# EAGLE design luci2_device_revB (EAGLE 6.5.0)
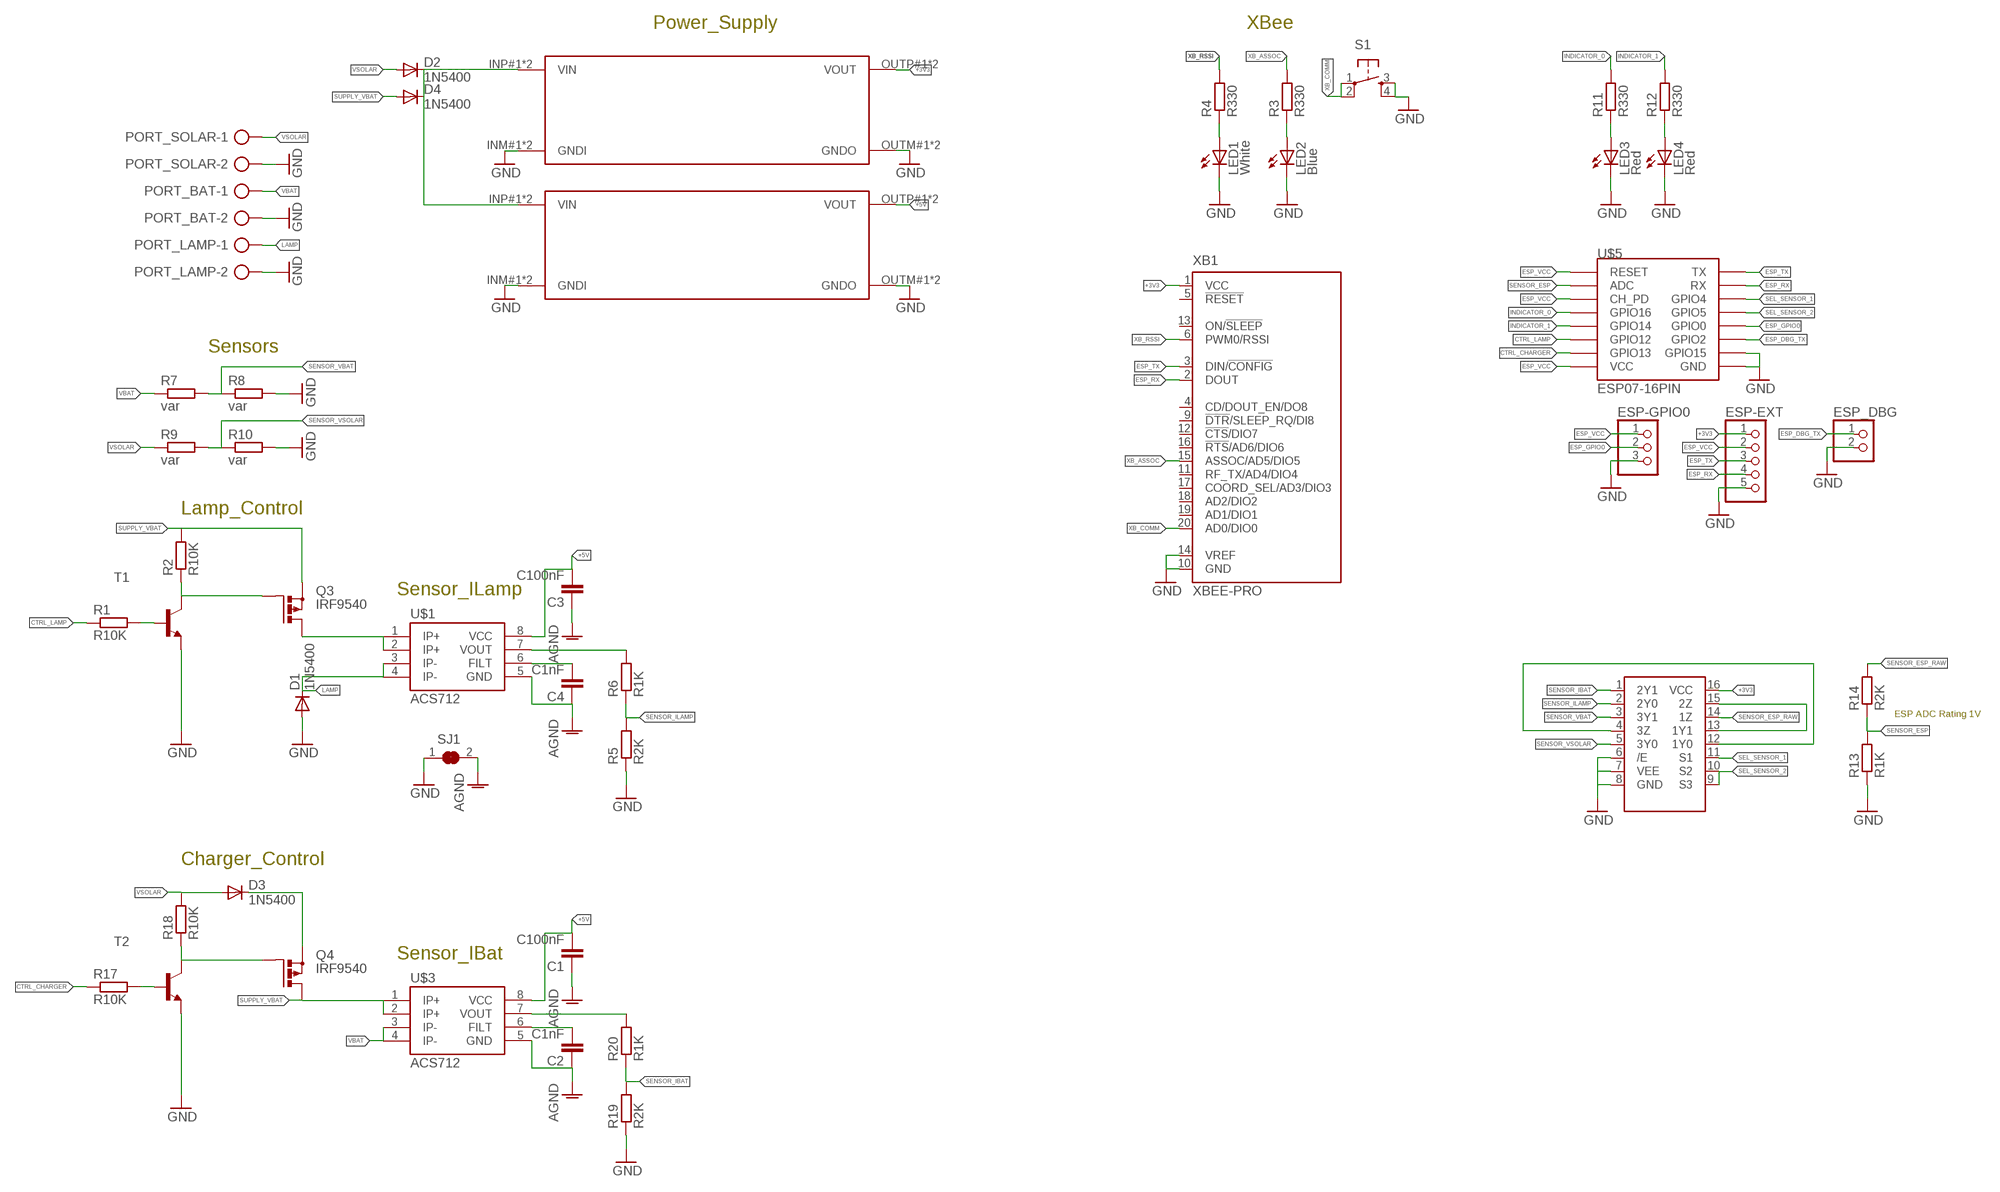
[diagram p0: schematic, sheet 1]

## Parts
C1  C100nF  C-EUC0805  [C0805]
C2  C1nF  C-EUC0805  [C0805]
C3  C100nF  C-EUC0805  [C0805]
C4  C1nF  C-EUC0805  [C0805]
D1  1N5400  [DO201-15]
D2  1N5400  [DO201-15]
D3  1N5400  [DO201-15]
D4  1N5400  [DO201-15]
ESP-EXT  HEADER-1X5ROUND  [1X05_ROUND]
ESP-GPIO0  HEADER-1X3ROUND  [1X03_ROUND]
ESP_DBG  HEADER-1X2ROUND  [1X02_ROUND]
LED1  White  LEDCHIPLED_0805  [CHIPLED_0805]
LED2  Blue  LEDCHIPLED_0805  [CHIPLED_0805]
LED3  Red  LEDCHIPLED_0805  [CHIPLED_0805]
LED4  Red  LEDCHIPLED_0805  [CHIPLED_0805]
PORT_BAT  AK300/2  [AK300/2]
PORT_LAMP  AK300/2  [AK300/2]
PORT_SOLAR  AK300/2  [AK300/2]
Q3  IRF9540  PMOSFET_PTO220BV  [TO220BV]
Q4  IRF9540  PMOSFET_PTO220BV  [TO220BV]
R1  R10K  R-EU_M0805  [M0805]
R2  R10K  R-EU_M0805  [M0805]
R3  R330  R-EU_M0805  [M0805]
R4  R330  R-EU_M0805  [M0805]
R5  R2K  R-EU_M0805  [M0805]
R6  R1K  R-EU_M0805  [M0805]
R7  var  R-EU_M0805  [M0805]
R8  var  R-EU_M0805  [M0805]
R9  var  R-EU_M0805  [M0805]
R10  var  R-EU_M0805  [M0805]
R11  R330  R-EU_M0805  [M0805]
R12  R330  R-EU_M0805  [M0805]
R13  R1K  R-EU_M0805  [M0805]
R14  R2K  R-EU_M0805  [M0805]
R17  R10K  R-EU_M0805  [M0805]
R18  R10K  R-EU_M0805  [M0805]
R19  R2K  R-EU_M0805  [M0805]
R20  R1K  R-EU_M0805  [M0805]
S1  TAC_SWITCHPTH  [TACTILE-PTH]
SJ1  SOLDERJUMPER_CLOSED  [SOLDERJUMPER_CLOSEDWIRE]
T1  MMBT2222ALT1-NPN-SOT23-BEC  [SOT23-BEC]
T2  MMBT2222ALT1-NPN-SOT23-BEC  [SOT23-BEC]
U$1  ACS712  [SO08]
U$2  DCDCMODULE_SMALL  [DCDCMODULE-SMALL]
U$3  ACS712  [SO08]
U$4  DCDCMODULE_SMALL  [DCDCMODULE-SMALL]
U$5  ESP07-16PIN  [ESP07-16PIN]
U$6  74HC4053D  [SO16]
XB1  XBEE-PRO  [XBEE-PRO]

## Nets
+3V3: ESP-EXT.1 U$4.OUTP#1(VOUT) U$4.OUTP#2(VOUT) U$6.16(VCC) XB1.1(VCC)
+5V: C1.2 C3.2 U$1.8(VCC) U$2.OUTP#1(VOUT) U$2.OUTP#2(VOUT) U$3.8(VCC)
AGND: C1.1 C2.1 C3.1 C4.1 SJ1.2 U$1.5(GND) U$3.5(GND)
CTRL_CHARGER: R17.1 U$5.GPIO13
CTRL_LAMP: R1.1 U$5.GPIO12
ESP_DBG_TX: ESP_DBG.1 U$5.GPIO2
ESP_GPIO0: ESP-GPIO0.2 U$5.GPIO0
ESP_RX: ESP-EXT.4 U$5.RX XB1.2(DOUT)
ESP_TX: ESP-EXT.3 U$5.TX XB1.3(DIN/!CONFIG)
ESP_VCC: ESP-EXT.2 ESP-GPIO0.1 U$5.CH_PD U$5.REST(RESET) U$5.VCC
GND: D1.A ESP-EXT.5 ESP-GPIO0.3 ESP_DBG.2 LED1.C LED2.C LED3.C LED4.C PORT_BAT.2 PORT_LAMP.2 PORT_SOLAR.2 R5.1 R8.2 R10.2 R13.1 R19.1 S1.3 S1.4 SJ1.1 T1.E T2.E U$2.INM#1(GNDI) U$2.INM#2(GNDI) U$2.OUTM#1(GNDO) U$2.OUTM#2(GNDO) U$4.INM#1(GNDI) U$4.INM#2(GNDI) U$4.OUTM#1(GNDO) U$4.OUTM#2(GNDO) U$5.GND U$5.GPIO15 U$6.6(/E) U$6.7(VEE) U$6.8(GND) XB1.10(GND) XB1.14(VREF)
INDICATOR_0: R11.2 U$5.GPIO16
INDICATOR_1: R12.2 U$5.GPIO14
LAMP: D1.C PORT_LAMP.1 U$1.3(IP-) U$1.4(IP-)
N$1: Q3.D U$1.1(IP+) U$1.2(IP+)
N$2: Q3.G R2.1 T1.C
N$3: LED1.A R4.1
N$4: R1.2 T1.B
N$5: LED2.A R3.1
N$6: U$6.13(1Y1) U$6.15(2Z)
N$7: R6.2 U$1.7(VOUT)
N$8 [VCC]: D2.C D4.C U$2.INP#1(VIN) U$2.INP#2(VIN) U$4.INP#1(VIN) U$4.INP#2(VIN)
N$9: U$6.4(3Z) U$6.12(1Y0)
N$10: R17.2 T2.B
N$11: C4.2 U$1.6(FILT)
N$12: Q4.G R18.1 T2.C
N$13: D3.C Q4.S
N$15: LED3.A R11.1
N$16: LED4.A R12.1
N$17: C2.2 U$3.6(FILT)
N$18: R20.2 U$3.7(VOUT)
SEL_SENSOR_1: U$5.GPIO4 U$6.11(S1)
SEL_SENSOR_2: U$5.GPIO5 U$6.9(S3) U$6.10(S2)
SENSOR_ESP: R13.2 R14.1 U$5.ADC
SENSOR_ESP_RAW: R14.2 U$6.14(1Z)
SENSOR_IBAT: R19.2 R20.1 U$6.1(2Y1)
SENSOR_ILAMP: R5.2 R6.1 U$6.2(2Y0)
SENSOR_VBAT: R7.2 R8.1 U$6.3(3Y1)
SENSOR_VSOLAR: R9.2 R10.1 U$6.5(3Y0)
SUPPLY_VBAT: D4.A Q3.S Q4.D R2.2 U$3.1(IP+) U$3.2(IP+)
VBAT: PORT_BAT.1 R7.1 U$3.3(IP-) U$3.4(IP-)
VSOLAR: D2.A D3.A PORT_SOLAR.1 R9.1 R18.2
XB_ASSOC: R3.2 XB1.15(ASSOC/AD5/DIO5)
XB_COMM: S1.1 S1.2 XB1.20(AD0/DIO0)
XB_RSSI: R4.2 XB1.6(PWM0/RSSI)
Unconnected: XB1.4(CD/DOUT_EN/DO8) XB1.5(!RESET) XB1.9(!DTR!/SLEEP_RQ/DI8) XB1.11(RF_TX/AD4/DIO4) XB1.12(!CTS!/DIO7) XB1.13(ON/!SLEEP) XB1.16(!RTS!/AD6/DIO6) XB1.17(COORD_SEL/AD3/DIO3) XB1.18(AD2/DIO2) XB1.19(AD1/DIO1)

## Notes on the sheet
- Power_Supply | XBee
- Sensors
- Lamp_Control
- Sensor_ILamp
- ESP ADC Rating 1V
- Charger_Control
- Sensor_IBat

## Library data of the parts
C1-C4 = resistor:C-EU: CAPACITOR, European symbol
D1-D4 = diode:1N5400: DIODE standard rectifier, 3 A, 50 V (Motorola)
ESP-EXT = microbuilder:HEADER-1X5: PIN HEADER
ESP-GPIO0 = microbuilder:HEADER-1X3: PIN HEADER
ESP_DBG = microbuilder:HEADER-1X2: PIN HEADER
LED1-LED4 = adafruit:LED: LED OSRAM: - CHIPLED LG R971, LG N971, LY N971, LG Q971, LY Q971, LO R971, LY R971 LH N974, LH R974 LS Q976, LO Q976, LY Q976 LO Q996 - Hyper CHIPLED LW Q18S LB Q993, LB Q99A, LB R99A - SideLED LS A670, LO A670, LY A670, LG A670, LP A670 LB A673, LV A673, LT A673, LW A673 LH A674 LY A675 LS A676, LA A676, LO A676, LY A676, LW A676 LS A679, LY A679, LG A679 - Hyper Micro SIDELED® LS Y876, LA Y876, LO Y876, LY Y876 LT Y87S - SmartLED LW L88C, LW L88S LB L89C, LB L89S, LG L890 LS L89K, LO L89K, LY L89K LS L896, LA L896, LO L896, LY L896 - TOPLED LS T670, LO T670, LY T670, LG T670, LP T670 LSG T670, LSP T670, LSY T670, LOP T670, LYG T670 LG T671, LOG T671, LSG T671 LB T673, LV T673, LT T673, LW T673 LH T674 LS T676, LA T676, LO T676, LY T676, LB T676, LH T676, LSB T676, LW T676 LB T67C, LV T67C, LT T67C, LS T67K, LO T67K, LY T67K, LW E67C LS E67B, LA E67B, LO E67B, LY E67B, LB E67C, LV E67C, LT E67C LW T67C LS T679, LY T679, LG T679 LS T770, LO T770, LY T770, LG T770, LP T770 LB T773, LV T773, LT T773, LW T773 LH T774 LS E675, LA E675, LY E675, LS T675 LS T776, LA T776, LO T776, LY T776, LB T776 LHGB T686 LT T68C, LB T68C - Hyper Mini TOPLED® LB M676 - Mini TOPLED Santana® LG M470 LS M47K, LO M47K, LY M47K Source: http://www.osram.convergy.de/
PORT_BAT PORT_LAMP PORT_SOLAR = con-ptr500:AK300/2: CONNECTOR; OC_FARNELL: unknown; OC_NEWARK: unknown
Q3 Q4 = transistor-power:PMOSFET_P: Power MOSFET P-Channel
R1-R14 R17-R20 = resistor:R-EU_: RESISTOR, European symbol
S1 = SparkFun-Electromechanical:TAC_SWITCH: Momentary Switch Button commonly used for reset or general input. Spark Fun Electronics SKU : COM-00097 SMT- SWCH-08247
SJ1 = microbuilder:SOLDERJUMPER_CLOSED: Solder Jumper - Closed These solder jumpers are closed by default CLOSEDWIRE - 10 mil trace between pads that can be cut and resoldered later CLOSEDPERM - 63 mil trace between pads for a permanent connection (used to 'bridge' two signals, a shameless hack for Eagle). Can double as a test point as well (no cream layer)
T1 T2 = transistor:*-NPN-: NPN Transistror BF959 corrected 2008.03.06
U$1 U$3 = SparkFun-AnalogIC:ACS712: Hall-effect-based isolated linear current sensor
U$2 U$4 = bontor:DCDCMODULE_SMALL
U$5 = esp8266modules:ESP07-16PIN: ESP8266 Wifi module 07 - 16 pins; DIMENSIONS: 22.0 x 16.0 mm; PINS: 16; PITCH: 0.078" / 2 mm
U$6 = tigorcustom:74HC4053D
XB1 = microbuilder:XBEE: XBee (TM) /XBee-PRO(TM) OEM RF Modules Source: MaxStream, Inc. xbee_productmanual.pdf

## Net classes
0 default: clearance 0.508 mm
1 GND: width 0.508 mm, drill 0.6 mm, clearance 0.762 mm
2 VCC: width 0.508 mm, drill 0.6 mm, clearance 0.762 mm

## Board
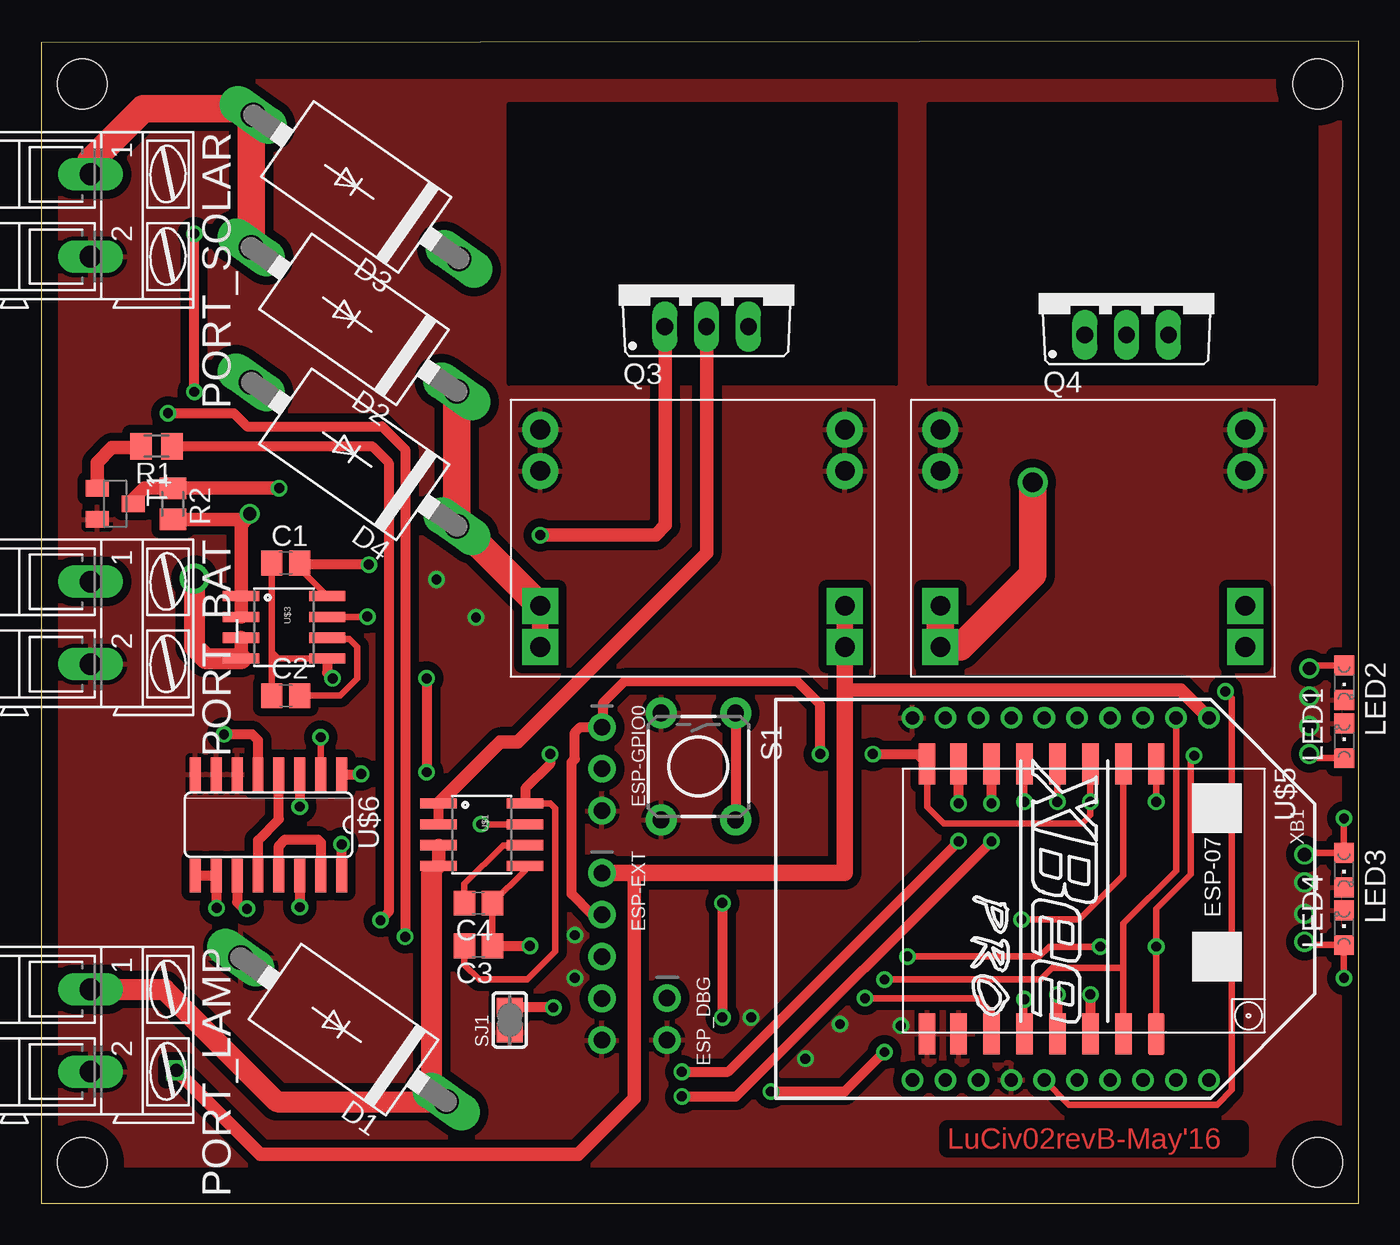
[diagram p1: board, top side]
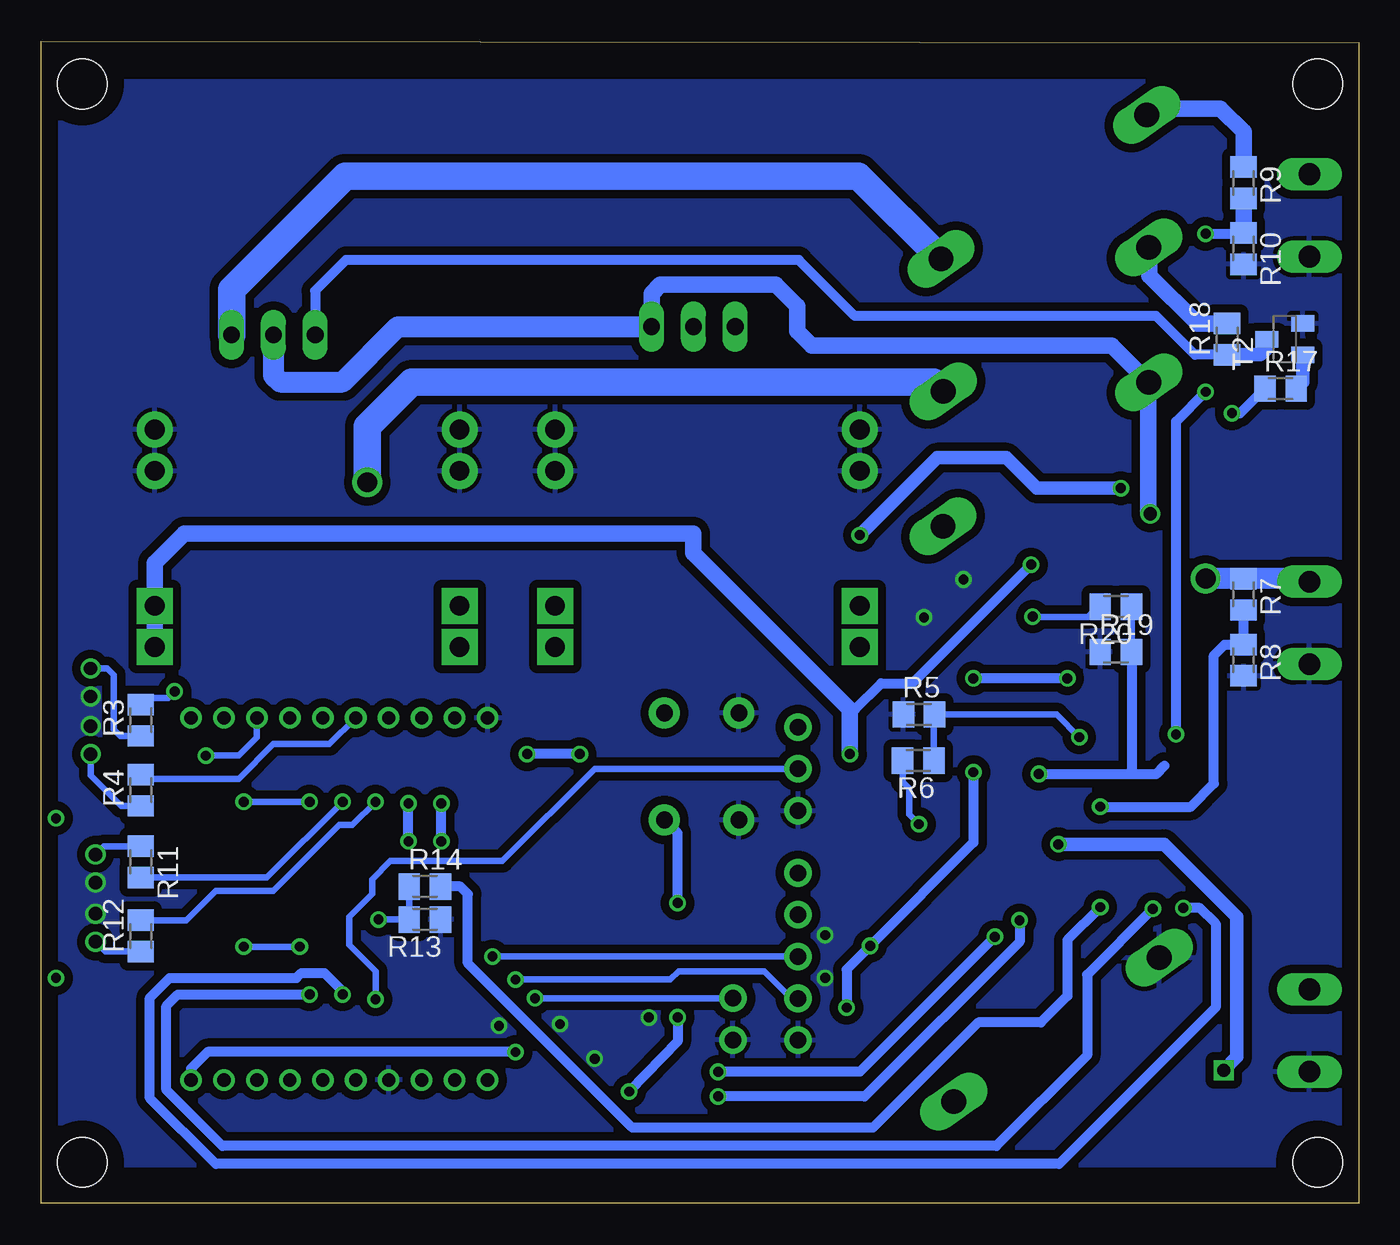
[diagram p2: board, bottom side, seen from below]

Size 80 x 70.6 mm. Coordinates in mm from the lower left corner, seen from the top.
Outline: 0,0 80,0 80,70.6 0,70.5 0,0
Copper layers (1*16): Top 0.035mm / dielectric 1.5mm / Bottom 0.035mm
Design rules "default": minimum track width 10mil, minimum drill 24mil, track to track 8mil, track to pad 8mil, pad to pad 8mil, via to via 8mil, smd to smd 8mil, copper to edge 40mil, drill to drill 8mil, minimum pad ring 10mil, minimum via ring 8mil, stop-mask expansion 4mil, vias tented up to drill 0mil, thermal gap 10mil
Holes 3 mm at 77.5,2.5 2.5,68 2.5,2.5 77.5,68
tKeepout: area 28.4,49.8 to 51.9,66.8; area 53.9,49.8 to 77.4,66.8

### Footprints (pad centres in the part's own frame; a part is rotated, then mirrored left to right if it is on the bottom)
C0805 = smd 1.3 x 1.5: 1 -0.85,0; 2 0.85,0
DO201-15 = drill 1.499 long: A 7.62,0; C -7.62,0
1X05_ROUND = drill 1 pad 1.676: 1 -5.08,0; 2 -2.54,0; 3 0,0; 4 2.54,0; 5 5.08,0
1X03_ROUND = drill 1 pad 1.676: 1 -2.54,0; 2 0,0; 3 2.54,0
1X02_ROUND = drill 1 pad 1.676: 1 -1.27,0; 2 1.27,0
CHIPLED_0805 = smd 1.2 x 1.2: A 0,-1.05; C 0,1.05
AK300/2 = drill 1.321 long: 1 -2.515,0; 2 2.489,0
TO220BV = drill 1.016 long: D 0,-2.54; G -2.54,-2.54; S 2.54,-2.54
M0805 = smd 1.3 x 1.6: 1 -0.95,0; 2 0.95,0
TACTILE-PTH = drill 1.016 pad 1.88: 1 -3.251,2.261; 2 3.251,2.261; 3 -3.251,-2.261; 4 3.251,-2.261
SOLDERJUMPER_CLOSEDWIRE = smd 1.168 x 1.6: 1 -0.762,0; 2 0.762,0 | smd 0.635 x 0.203: WIRE 0,0
SOT23-BEC = smd 1 x 1.4: B -0.95,-1.1; C 0,1.1; E 0.95,-1.1
SO08 = smd 0.61 x 2.21: 1 -1.905,-2.616; 2 -0.635,-2.616; 3 0.635,-2.616; 4 1.905,-2.616; 5 1.905,2.616; 6 0.635,2.616; 7 -0.635,2.616; 8 -1.905,2.616
DCDCMODULE-SMALL = drill 1.2 pad 2.184: INM#1 1.8,15; INM#2 1.8,12.5; OUTM#1 20.3,15; OUTM#2 20.3,12.5 | drill 1.2 pad 2.184 square: INP#1 1.8,4.3; INP#2 1.8,1.8; OUTP#1 20.3,4.3; OUTP#2 20.3,1.8
ESP07-16PIN = smd 2.5 x 1: ADC -8.2,3.8; CH_PD -8.2,1.8; GND 8.2,-8.105; GPIO0 8.2,-2.2; GPIO2 8.2,-4.2; GPIO4 8.2,1.8; GPIO5 8.2,-0.2; GPIO12 -8.2,-4.2; GPIO13 -8.2,-6.2; GPIO14 -8.2,-2.2; GPIO15 8.2,-6.2; GPIO16 -8.2,-0.2; REST -8.2,5.8; RX 8.2,3.8; TX 8.2,5.8; VCC -8.2,-8.105
SO16 = smd 0.66 x 2.032: 1 -4.445,-3.073; 2 -3.175,-3.073; 3 -1.905,-3.073; 4 -0.635,-3.073; 5 0.635,-3.073; 6 1.905,-3.073; 7 3.175,-3.073; 8 4.445,-3.073; 9 4.445,3.073; 10 3.175,3.073; 11 1.905,3.073; 12 0.635,3.073; 13 -0.635,3.073; 14 -1.905,3.073; 15 -3.175,3.073; 16 -4.445,3.073
XBEE-PRO = drill 0.8 pad 1.27: 1 -11,9; 2 -11,7; 3 -11,5; 4 -11,3; 5 -11,1; 6 -11,-1; 7 -11,-3; 8 -11,-5; 9 -11,-7; 10 -11,-9; 11 11,-9; 12 11,-7; 13 11,-5; 14 11,-3; 15 11,-1; 16 11,1; 17 11,3; 18 11,5; 19 11,7; 20 11,9

### Placement (x,y rotation side)
C1  14.85,38.9 0 top
C2  14.85,30.85 0 top
C3  26.55,15.65 180 top
C4  26.55,18.25 180 top
D1  18.36,10.56 145 top
D2  18.99,53.7 145 top
D3  19.12,61.75 145 top
D4  19,45.5 145 top
ESP-EXT  34.05,15 270 top
ESP-GPIO0  34.05,26.4 270 top
ESP_DBG  38,11.2 270 top
LED1  79.11,28.1 0 top
LED2  79.11,31.63 180 top
LED3  79.1,20.25 180 top
LED4  79.1,16.75 0 top
PORT_BAT  3,35.25 270 top
PORT_LAMP  3,10.5 270 top
PORT_SOLAR  3,60 270 top
Q3  40.4,55.8 0 top
Q4  65.9,55.3 0 top
R1  7,46 180 top
R2  8,42.5 270 top
R3  73.95,29.35 90 bottom
R4  73.95,25.1 90 bottom
R5  26.7,29.7 0 bottom
R6  26.75,26.9 180 bottom
R7  7,37 270 bottom
R8  7,33 270 bottom
R9  7,62 270 bottom
R10  7,58 270 bottom
R11  73.95,20.75 270 bottom
R12  73.95,16.25 90 bottom
R13  56.7,17.25 180 bottom
R14  56.7,19.25 0 bottom
R17  4.75,49.5 0 bottom
R18  8,52.5 90 bottom
R19  14.75,33.5 0 bottom
R20  14.75,36.25 180 bottom
S1  39.9,26.55 270 top
SJ1  28.45,11.15 90 top
T1  4.5,42.5 270 top
T2  4.5,52.5 90 bottom
U$1  26.75,22.4 270 top
U$2  52.8,32 0 top
U$3  14.75,35 270 top
U$4  28.5,32 0 top
U$5  61.9,18.5 270 top
U$6  13.8,23 180 top
XB1  61.9,18.5 270 top

### Tracks (layer width: path | path; a pad name or v marks a point on that pad's centre or on a via)
+3V3  (via drill 0.6, 0.8)
  Top 0.61: U$6.16 v18.25,21.82
  Top 0.813: 36,20.08 36,6.4 32.6,3 13.3,3 v8.2,8.1 | XB1.1 69.2,31.2 48.8,31.2
  Top 1.016: U$4.OUTP#1 U$4.OUTP#2 48.8,31.2 48.8,20.08 36,20.08 ESP-EXT.1
  Bottom 0.813: v18.25,21.82 11.82,21.82 7.4,17.4 7.4,8.9 v8.2,8.1
+5V  (via drill 0.6)
  Top 0.406: C1.2 15.7,38.57 U$3.8 | U$1.8 30.89,24.3 31.2,24 31.2,15.3 29.5,13.6 26.6,13.6 25.7,14.5 C3.2
  Top 0.61: v30.9,27.3 30.9,26.7 29.4,25.2 29.4,24.34 U$1.8 | v19.9,38.8 15.8,38.8 C1.2
  Bottom 0.61: 30.9,30 30.6,30 29,31.6 27.1,31.6 v19.9,38.8
  Bottom 1.016: v30.9,27.3 30.9,30 40.4,39.5 40.4,40.7 71.3,40.7 73.1,38.9 U$2.OUTP#1 U$2.OUTP#2
AGND  (via drill 0.6)
  Top 0.406: U$3.5 14.4,33.09 14,33.5 | C2.1 14,33.5 | C1.1 14,33.5 | U$1.5 29.37,20.22 C4.1 C3.1
  Top 0.61: C3.1 v29.67,15.65 | v31.1,11.9 31.09,11.91 SJ1.2 | U$3.5 17.37,32.23 v17.7,31.9 | v23.4,31.9 v23.4,26.2
  Bottom 0.61: v31.1,11.9 31.1,14.22 v29.67,15.65 23.4,21.92 v23.4,26.2 | v17.7,31.9 v23.4,31.9
CTRL_CHARGER  (via drill 0.6)
  Top 0.61: v7.7,48 11.7,48 12.5,47.2 20.7,47.2 22.1,45.8 v22.1,16.2 | v38.9,8 41.7,8 v55.7,22 | v55.7,24.3 U$5.GPIO13
  Bottom 0.61: R17.1 7.2,48 v7.7,48 | v22.1,16.2 30.3,8 v38.9,8 | v55.7,22 v55.7,24.3
CTRL_LAMP  (via drill 0.6)
  Top 0.61: R1.1 20.1,46 21.1,45 21.1,17.7 v20.6,17.2 | v38.9,6.5 42.2,6.5 v57.7,22 | v57.7,24.3 U$5.GPIO12
  Bottom 0.61: v20.6,17.2 20.6,15.9 30,6.5 v38.9,6.5 | v57.7,22 v57.7,24.3
ESP_DBG_TX  (via drill 0.6)
  Top 0.406: v50.02,12.47 56.83,12.47 57.7,11.6 U$5.GPIO2
  Bottom 0.406: ESP_DBG.1 v50.02,12.47
ESP_GPIO0  (via drill 0.6)
  Top 0.406: U$5.GPIO0 v59.7,12.4
  Bottom 0.406: v59.7,12.4 59.7,14.1 61.3,15.7 61.3,17.4 59.9,18.8 59.9,19.7 58.8,20.8 52,20.8 46.4,26.4 ESP-GPIO0.2
ESP_RX  (via drill 0.6)
  Top 0.406: XB1.2 68.9,20.2 65.7,17 65.7,14.3 | 65.7,14.3 U$5.RX | v51.2,13.6 60.7,13.6 61.4,14.3 65.7,14.3
  Bottom 0.406: ESP-EXT.4 34.46,12.46 36.1,14.1 41.3,14.1 41.8,13.6 v51.2,13.6
ESP_TX  (via drill 0.6)
  Top 0.406: v70,27.2 69.8,27 69.8,20 67.7,17.9 v67.7,15.6 U$5.TX | v52.6,15 60.6,15 61.2,15.6 v64.3,15.6
  Bottom 0.406: v70,27.2 68,27.2 66.9,28.3 XB1.3 | ESP-EXT.3 v52.6,15 | v64.3,15.6 v67.7,15.6
ESP_VCC  (via drill 0.6)
  Top 0.406: U$5.CH_PD v63.7,24.4 63.7,23.6 63.2,23.1 54.8,23.1 53.8,24.1 U$5.VCC | v67.7,24.4 U$5.REST
  Top 0.61: ESP-EXT.2 33.46,17.54 32.2,18.8 32.2,26.8 32.4,27 32.4,28.6 32.74,28.94 ESP-GPIO0.1 34.1,28.99 34.1,30.4 35.4,31.7 45.9,31.7 47.3,30.3 v47.3,27.3 | v50.5,27.3 53.2,27.3 U$5.VCC
  Bottom 0.406: v63.7,24.4 v67.7,24.4
  Bottom 0.61: v47.3,27.3 v50.5,27.3
GND  (via drill 0.6, 0.81)
  other vias: 52.2,10.8 48.5,10.9 46.4,8.8 43.1,11.3 76.7,19.5 76.7,17.6 77,30.8 77,29 24,37.9 26.4,35.6 32.4,16.3 32.4,13.7
  pour Top: 0,70.5 80,70.5 80,0 0,0
  pour Bottom: 0,70.5 80,70.5 80,0 0,0
HEATSINK
  cutout Top: 28.4,66.8 51.9,66.8 51.9,49.8 28.4,49.8
HEATSINK2
  cutout Top: 53.9,66.8 77.4,66.8 77.4,49.8 53.9,49.8
INDICATOR_0  (via drill 0.6)
  Top 0.406: v61.7,24.4 U$5.GPIO16
  Bottom 0.406: v61.7,24.4 66.3,19.8 R11.2
INDICATOR_1  (via drill 0.6)
  Top 0.406: v59.7,24.4 U$5.GPIO14
  Bottom 0.406: v59.7,24.4 61.1,23 61.9,23 65.9,19 69.4,19 71.2,17.2 R12.2
LAMP
  Top 0.813: 23.7,20 24.13,20.43 U$1.4 U$1.3
  Top 1.27: PORT_LAMP.1 7.49,13.02 14.31,6.19 D1.C 23.7,6.79 23.7,20
N$1
  Top 0.61: U$1.2 U$1.1
  Top 0.813: Q3.D 40.4,39.5 28.93,28.03 27.86,28.03 U$1.1
N$2  (via drill 0.6)
  Top 0.813: T1.C 5.6,42.8 6.25,43.45 R2.1 v14.45,43.45 | v30.3,40.6 37.3,40.6 37.9,41.2 37.9,53.22 Q3.G
  Bottom 0.813: v30.3,40.6 25.6,45.3 21.4,45.3 19.55,43.45 v14.45,43.45
N$3  (via drill 0.81)
  Top 0.406: LED1.A 77.25,27.05 v77,27.3
  Bottom 0.406: R4.1 75.15,24.15 77,26 v77,27.3
N$4
  Top 0.813: T1.B 3.4,45 4.3,45.9 5.95,45.9 R1.2
N$5  (via drill 0.81)
  Top 0.406: LED2.A 77.18,32.68 v77,32.5
  Bottom 0.406: R3.1 75.2,28.4 75.6,28.8 75.6,32.1 76,32.5 v77,32.5
N$6
  Top 0.61: U$6.13 14.44,21.73 14.8,22.1 16.8,22.1 16.98,21.93 U$6.15
N$7  (via drill 0.6)
  Top 0.406: U$1.7 27.54,23.04 v26.71,23.04
  Bottom 0.406: 27.5,26.7 R6.2 27.7,25.6 27.3,25.2 27.3,23.63 v26.71,23.04
N$8  (via drill 1.2)
  Top 1.016: D4.C 25.47,41.13 | U$4.INP#1 U$4.INP#2
  Top 1.676: D2.C D4.C | 25.47,41.13 U$4.INP#1 | v60.2,43.8 60.2,38.2 55.8,33.8 U$2.INP#2 U$2.INP#1
  Bottom 1.016: D4.C
  Bottom 1.676: D2.C 25.81,49.9 57.5,49.9 60.2,47.2 v60.2,43.8
N$9
  Top 0.61: U$6.12 13.16,22.07 14.44,23.34 U$6.4
N$10
  Bottom 0.813: T2.B 3.4,49.9 R17.2
N$11
  Top 0.406: C4.2 25.7,19.4 28.07,21.77 U$1.6
N$12
  Bottom 0.61: R18.1 9.95,51.55 12.3,53.9 30.6,53.9 34,57.3 61.5,57.3 63.36,55.44 Q4.G
  Bottom 0.813: T2.C 5.6,51.92 5.97,51.55 R18.1
N$13
  Bottom 1.676: D3.C 30.38,62.4 61.54,62.4 68.44,55.5 Q4.S
N$14
  cutout Top: 0,70.5 80,70.5 80,68.5 0,68.5
N$15  (via drill 0.6, 0.81)
  Top 0.406: v79.1,23.4 LED3.A 76.8,21.3 v76.7,21.2
  Bottom 0.406: R11.1 76.2,21.7 v76.7,21.2
N$16  (via drill 0.6, 0.81)
  Top 0.406: v79.1,13.7 LED4.A 76.9,15.7 v76.7,15.9
  Bottom 0.406: R12.1 76.1,15.3 v76.7,15.9
N$17
  Top 0.406: C2.2 18.15,30.85 19.2,31.9 19.2,33.8 18.7,34.3 17.43,34.3 U$3.6
N$18  (via drill 0.6)
  Top 0.406: U$3.7 19.79,35.63 v19.8,35.65
  Bottom 0.406: R20.2 15.84,36.25 16.46,35.63 19.78,35.63 v19.8,35.65
N$19
  cutout Top: 0,0 80,0 80,2 0,2
N$20
  cutout Bottom: 0,70.5 80,70.5 80,68.5 0,68.5
N$21
  cutout Bottom: 0,2 80,2 80,0 0,0
SEL_SENSOR_1  (via drill 0.6)
  Top 0.61: U$6.11 11.89,18.3 12.3,17.9 v12.5,17.9 | v63.7,12.7 U$5.GPIO4
  Bottom 0.61: v12.5,17.9 16.5,13.9 16.5,9 22,3.5 69,3.5 72.4,6.9 72.4,12 71.7,12.7 v63.7,12.7
SEL_SENSOR_2  (via drill 0.6)
  Top 0.61: U$6.9 U$6.10 10.62,17.98 v10.65,17.95 | v61.7,12.7 U$5.GPIO5
  Bottom 0.61: v10.65,17.95 9.65,17.95 8.7,17 8.7,11.9 18.2,2.4 69.4,2.4 73.4,6.4 73.4,12.5 72.2,13.7 64.5,13.7 64.2,14 62.8,14 61.7,12.9 v61.7,12.7
SENSOR_ESP  (via drill 0.6)
  Top 0.406: U$5.ADC 65.7,19.92 63.03,17.25 v59.52,17.25
  Bottom 0.406: v59.52,17.25 R13.2 R14.1
SENSOR_ESP_RAW  (via drill 0.6)
  Top 0.61: U$6.14 v15.7,18
  Bottom 0.61: v15.7,18 17.7,16 17.7,12.6 19.3,11 23.1,11 29.5,4.6 44.1,4.6 54.1,14.6 54.1,18.8 54.55,19.25 R14.2
SENSOR_IBAT  (via drill 0.6)
  Top 0.61: U$6.1 19.41,26.07 v19.43,26.09
  Bottom 0.406: R20.1 R19.2
  Bottom 0.61: v19.43,26.09 14,26.09 | 14,26.09 12.31,26.09 11.8,26.6 | R19.2 13.8,26.29 14,26.09
SENSOR_ILAMP  (via drill 0.6)
  Top 0.406: U$6.2 v16.98,28.32 v16.97,28.32
  Bottom 0.406: R6.1 25.8,29.65 R5.2 18.35,29.7 v16.97,28.32
SENSOR_VBAT  (via drill 0.6)
  Top 0.61: U$6.3 v15.71,24.11 v15.7,24.1
  Bottom 0.61: v15.7,24.1 10.2,24.1 8.8,25.5 8.8,33.3 8.15,33.95 R8.1 R7.2
SENSOR_VSOLAR  (via drill 0.6)
  Top 0.61: U$6.5 13.16,28.14 12.8,28.5 v11.1,28.5 | v9.3,49.3 v9.3,58.9
  Bottom 0.61: v11.1,28.5 11.1,47.5 v9.3,49.3 | v9.3,58.9 7.05,58.9 R10.1
  Bottom 1.016: R9.2 R10.1
SUPPLY_VBAT  (via drill 0.8)
  Top 0.813: R2.2 11.92,41.55 12.13,41.33 | 12.13,41.33 U$3.1 U$3.2 | 12.13,41.33 12.25,41.45
  Top 1.016: v12.67,41.89 12.25,41.45
  Bottom 1.016: Q3.S 42.94,55.26 42.4,55.8 35.4,55.8 34.1,54.5 34.1,53 33.2,52.1 14.99,52.1 D4.A 12.77,48.22 12.77,41.99 v12.67,41.89
  Bottom 1.27: Q4.D 65.9,50.3 65.5,49.9 61.7,49.9 58.34,53.26 Q3.S
VBAT  (via drill 1.2)
  Top 0.813: U$3.3 U$3.4
  Top 1.27: v9.3,37.96 9.3,33.8 10,33.1 U$3.4
  Bottom 1.27: PORT_BAT.1 3.19,37.95 R7.1 v9.29,37.95 v9.3,37.96
VSOLAR
  Top 1.016: 12.75,65.99 D3.A
  Top 1.27: PORT_SOLAR.1 3,63.3
  Top 1.676: 3,63.3 6.2,66.5 12.5,66.5 D3.A | D2.A 12.75,65.99
  Bottom 1.016: R9.1 7,65.1 8.4,66.5 12.5,66.5 D3.A | D2.A 12.73,56.35 9.79,53.44 R18.2
XB_ASSOC  (via drill 0.6)
  Top 0.406: XB1.15 62.4,6 71.4,6 72.3,6.9 72.3,30.7 v71.9,31.1
  Bottom 0.406: R3.2 73.55,30.7 72.3,30.7 v71.9,31.1
XB_COMM  (via drill 0.6)
  Top 0.61: v41.36,18.25 41.36,11.41 v41.36,11.31 | v44.3,6.8 48.8,6.8 v51.2,9.2 | S1.1 S1.2
  Bottom 0.61: v41.36,11.31 41.36,9.84 v44.3,6.8 | v51.2,9.2 69.9,9.2 70.9,8.2 XB1.20 | v41.36,18.25 41.36,22.5 S1.2
XB_RSSI
  Bottom 0.406: XB1.6 62.5,27.9 65.9,27.9 68,25.8 73.7,25.8 R4.2

### Text on the board
Top: LuCiv02revB-May'16